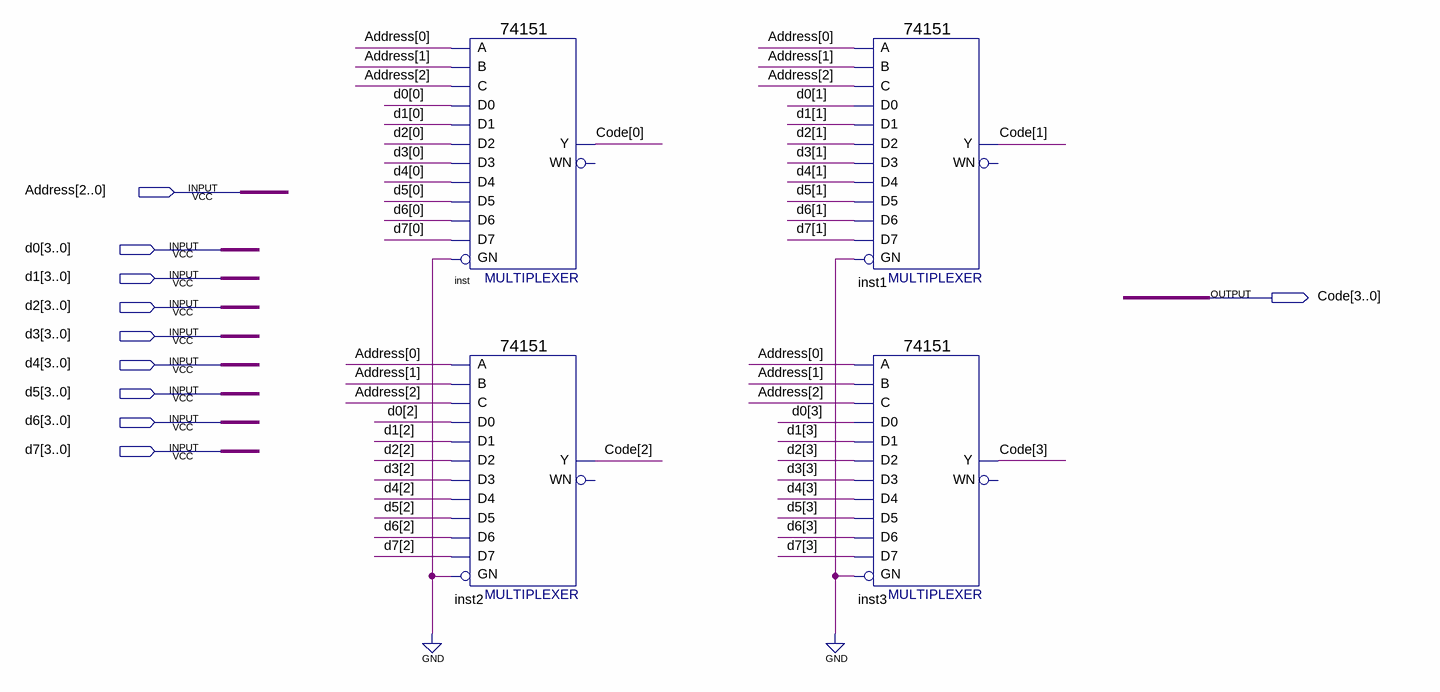
[diagram p0: schematic sheet]
// Quartus schematic MUX151_8_4.bdf as structural Verilog: 4 symbols, 10 pins
module MUX151_8_4 (
  input  [2:0] Address,
  input  [3:0] d0,
  input  [3:0] d1,
  input  [3:0] d2,
  input  [3:0] d3,
  input  [3:0] d4,
  input  [3:0] d5,
  input  [3:0] d6,
  input  [3:0] d7,
  output [3:0] Code
);

  \74151  inst (
    .GN(1'b0), .C(Address[2]), .B(Address[1]), .A(Address[0]), .D5(d5[0]), .D0(d0[0]), .D1(d1[0]),
    .D4(d4[0]), .D3(d3[0]), .D2(d2[0]), .D6(d6[0]), .D7(d7[0]), .Y(Code[0]));  // open: WN
  \74151  inst2 (
    .GN(1'b0), .C(Address[2]), .B(Address[1]), .A(Address[0]), .D5(d5[2]), .D0(d0[2]), .D1(d1[2]),
    .D4(d4[2]), .D3(d3[2]), .D2(d2[2]), .D6(d6[2]), .D7(d7[2]), .Y(Code[2]));  // open: WN
  \74151  inst1 (
    .GN(1'b0), .C(Address[2]), .B(Address[1]), .A(Address[0]), .D5(d5[1]), .D0(d0[1]), .D1(d1[1]),
    .D4(d4[1]), .D3(d3[1]), .D2(d2[1]), .D6(d6[1]), .D7(d7[1]), .Y(Code[1]));  // open: WN
  \74151  inst3 (
    .GN(1'b0), .C(Address[2]), .B(Address[1]), .A(Address[0]), .D5(d5[3]), .D0(d0[3]), .D1(d1[3]),
    .D4(d4[3]), .D3(d3[3]), .D2(d2[3]), .D6(d6[3]), .D7(d7[3]), .Y(Code[3]));  // open: WN
endmodule
